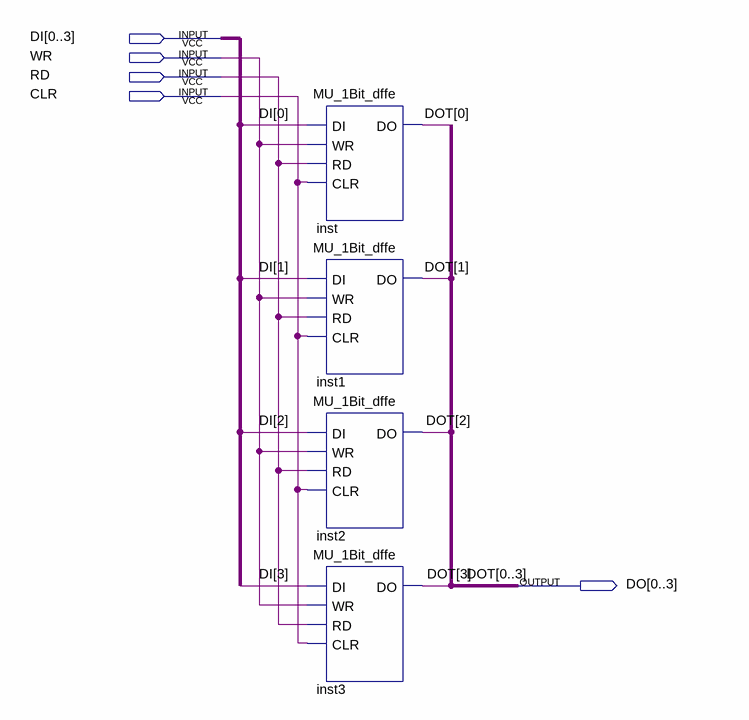
[diagram p0: schematic sheet]
// Quartus schematic TABLE_4Bit.bdf as structural Verilog: 4 symbols, 5 pins
module TABLE_4Bit (
  input  [0:3] DI,
  input  WR,
  input  RD,
  input  CLR,
  output [0:3] DO
);

  MU_1Bit_dffe inst (.DI(DI[0]), .WR(WR), .RD(RD), .CLR(CLR), .DO(DO[0]));
  MU_1Bit_dffe inst1 (.DI(DI[1]), .WR(WR), .RD(RD), .CLR(CLR), .DO(DO[1]));
  MU_1Bit_dffe inst2 (.DI(DI[2]), .WR(WR), .RD(RD), .CLR(CLR), .DO(DO[2]));
  MU_1Bit_dffe inst3 (.DI(DI[3]), .WR(WR), .RD(RD), .CLR(CLR), .DO(DO[3]));

  // Other names for the same wires on the sheet: DOT[3:0] = {DO[3], DO[2], DO[1], DO[0]}
endmodule
